# EasyEDA Pro project BLDC_DRIVERv2.eprj

# Schematic Schematic1
Create Date: 2024-09-20; Page Name: P1; Project Name: BLDC_DRIVERv2; Schematic Name: Schematic1; Update Date: 2024-09-20; Company: EasyEDA.com; Drawn: EasyEDA; Page Size: A4; Part Number: JLCPCB-002; Reviewed: EasyEDA; Version: V0.1
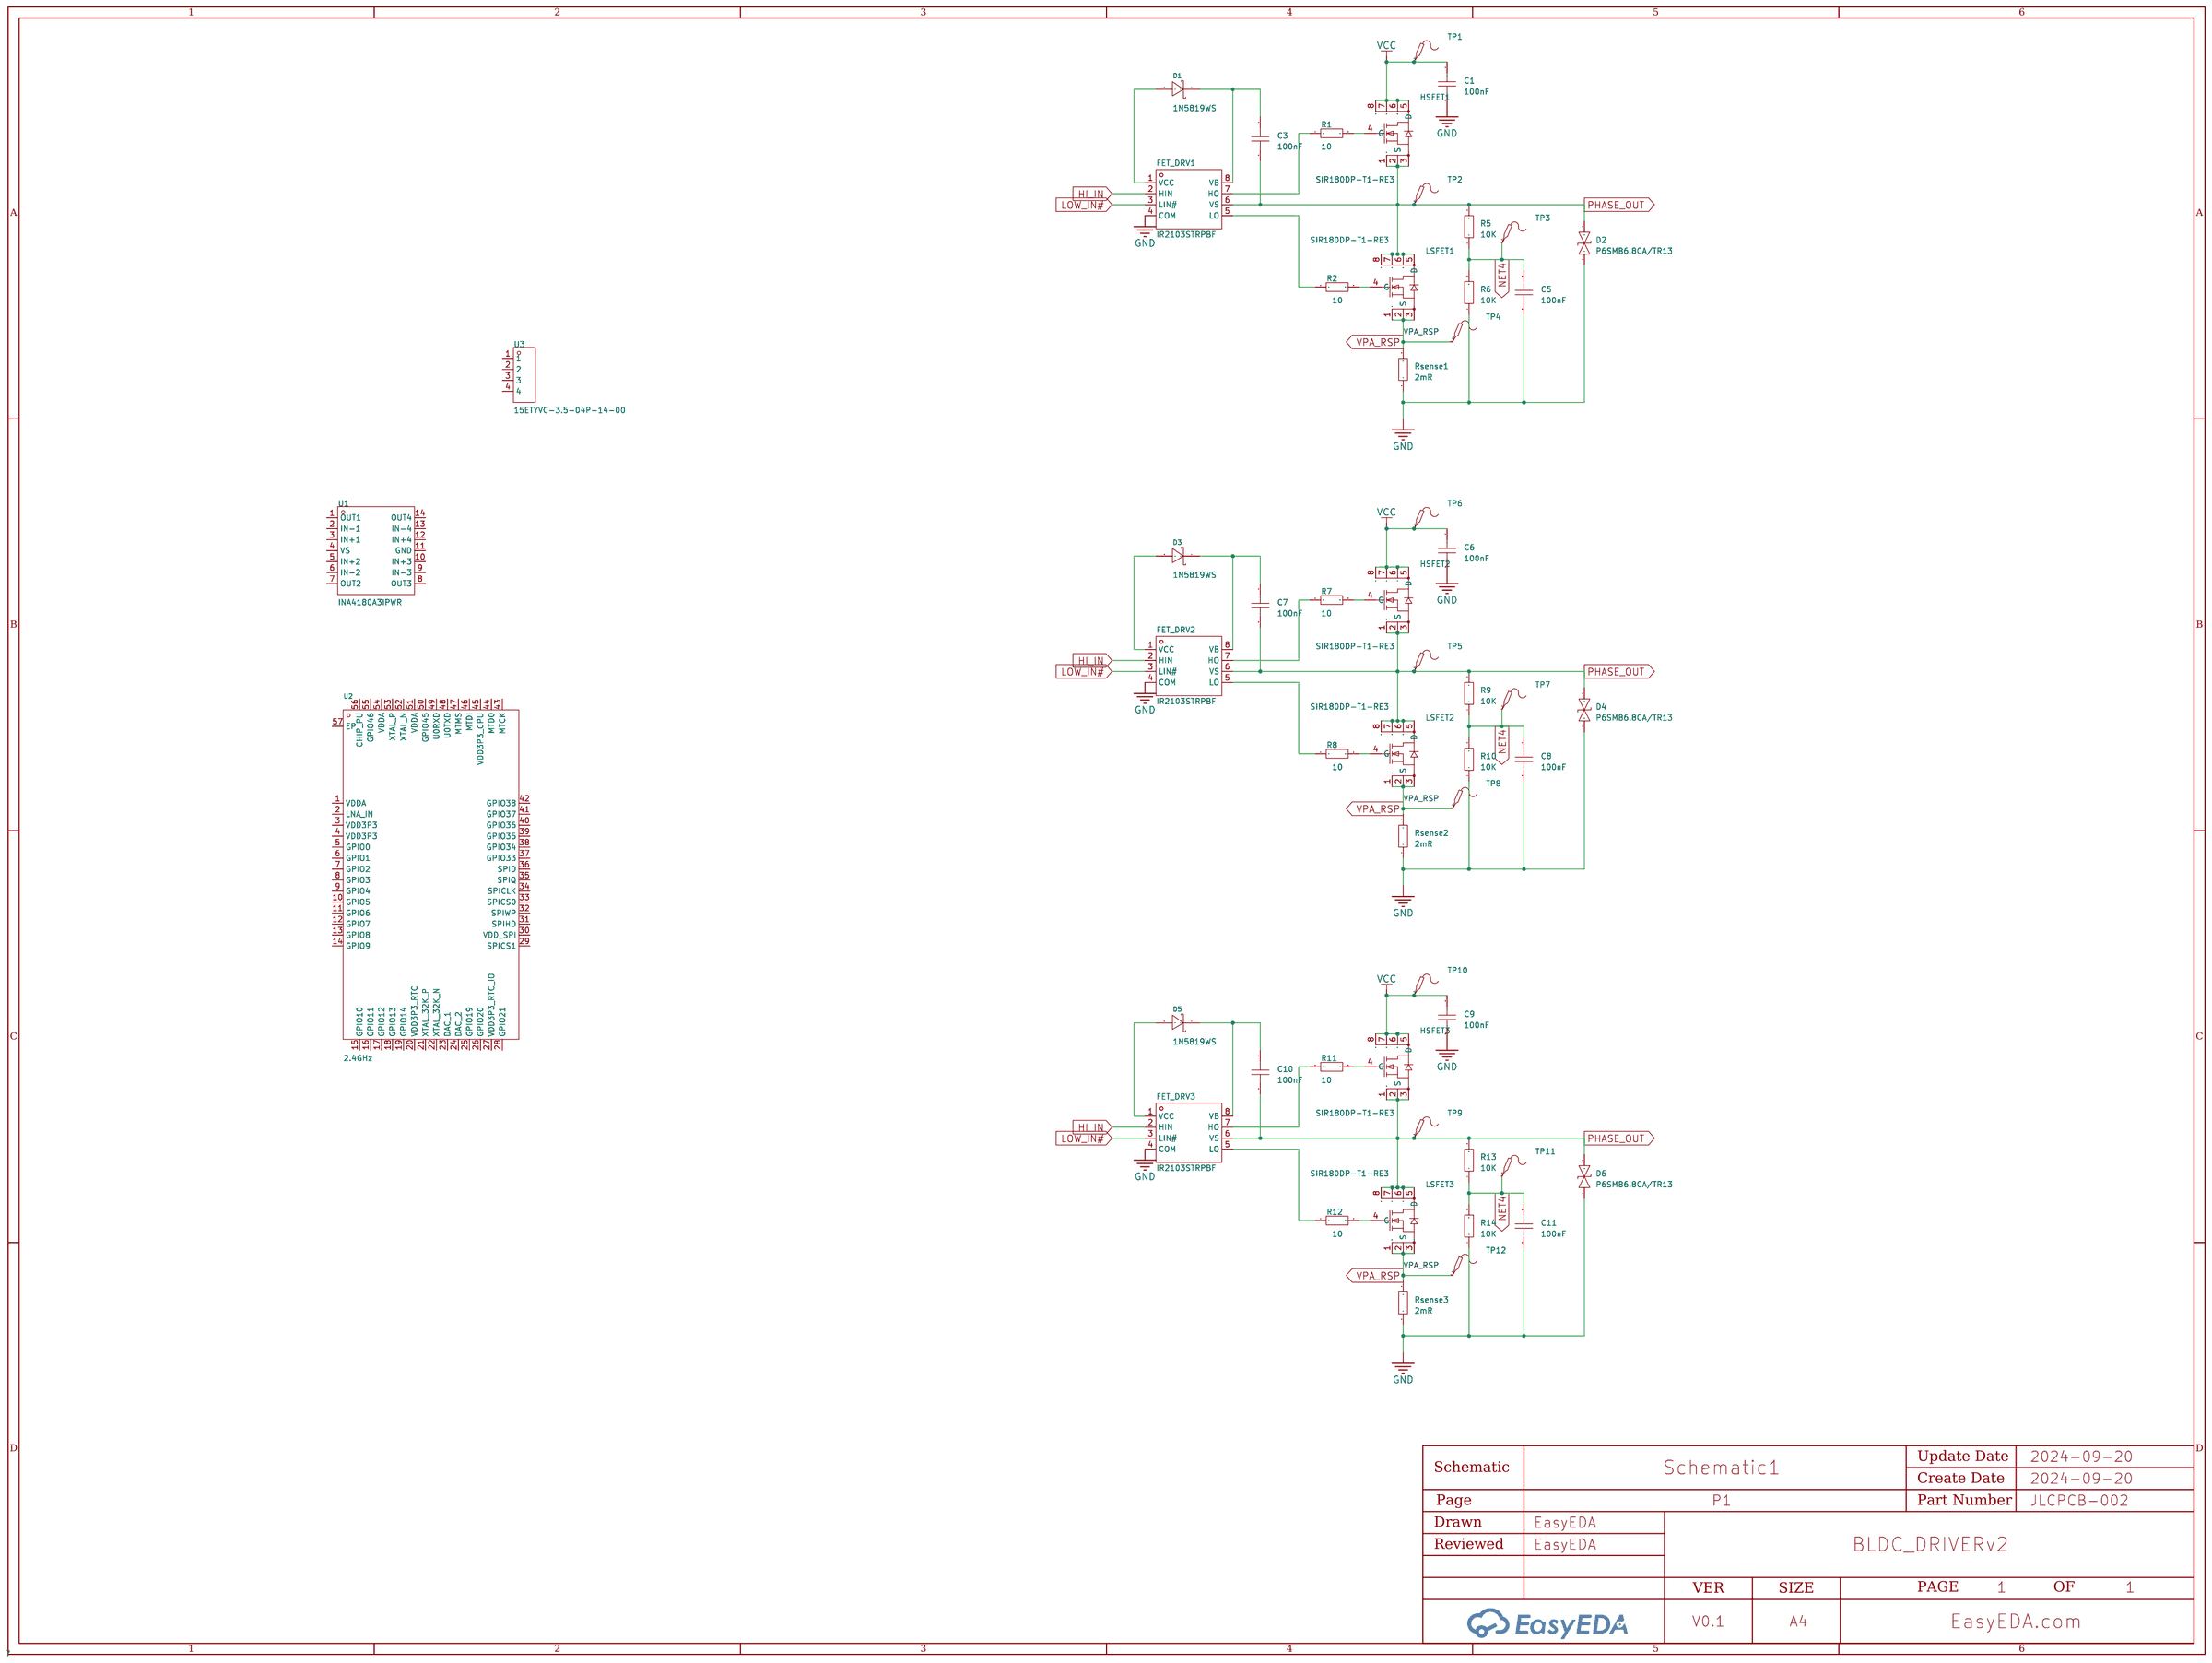
[diagram p0: schematic sheet]

## Parts
C1  100nF  [C0603]
C3  100nF  [C0603]
C5  100nF  [C0603]
C6  100nF  [C0603]
C7  100nF  [C0603]
C8  100nF  [C0603]
C9  100nF  [C0603]
C10  100nF  [C0603]
C11  100nF  [C0603]
D1  1N5819WS  [SOD-323_L1.8-W1.3-LS2.5-RD]
D2  P6SMB6.8CA/TR13  [SMB_L4.6-W3.6-LS5.3-BI]
D3  1N5819WS  [SOD-323_L1.8-W1.3-LS2.5-RD]
D4  P6SMB6.8CA/TR13  [SMB_L4.6-W3.6-LS5.3-BI]
D5  1N5819WS  [SOD-323_L1.8-W1.3-LS2.5-RD]
D6  P6SMB6.8CA/TR13  [SMB_L4.6-W3.6-LS5.3-BI]
FET_DRV1  IR2103STRPBF  [SOIC-8_L4.9-W3.9-P1.27-LS6.0-BL]
FET_DRV2  IR2103STRPBF  [SOIC-8_L4.9-W3.9-P1.27-LS6.0-BL]
FET_DRV3  IR2103STRPBF  [SOIC-8_L4.9-W3.9-P1.27-LS6.0-BL]
HSFET1  SIR180DP-T1-RE3  [POWERPAK-SO-8_L5.9-W4.9-P1.27-LS6.2-BL]
HSFET2  SIR180DP-T1-RE3  [POWERPAK-SO-8_L5.9-W4.9-P1.27-LS6.2-BL]
HSFET3  SIR180DP-T1-RE3  [POWERPAK-SO-8_L5.9-W4.9-P1.27-LS6.2-BL]
LSFET1  SIR180DP-T1-RE3  [POWERPAK-SO-8_L5.9-W4.9-P1.27-LS6.2-BL]
LSFET2  SIR180DP-T1-RE3  [POWERPAK-SO-8_L5.9-W4.9-P1.27-LS6.2-BL]
LSFET3  SIR180DP-T1-RE3  [POWERPAK-SO-8_L5.9-W4.9-P1.27-LS6.2-BL]
R1  10  [R0603]
R2  10  [R0603]
R5  10K  [R0603]
R6  10K  [R0603]
R7  10  [R0603]
R8  10  [R0603]
R9  10K  [R0603]
R10  10K  [R0603]
R11  10  [R0603]
R12  10  [R0603]
R13  10K  [R0603]
R14  10K  [R0603]
Rsense1  2mR  [R0603]
Rsense2  2mR  [R0603]
Rsense3  2mR  [R0603]
TP1  -  [Test-Point-0.5mm]
TP2  -  [Test-Point-0.5mm]
TP3  -  [Test-Point-0.5mm]
TP4  -  [Test-Point-0.5mm]
TP5  -  [Test-Point-0.5mm]
TP6  -  [Test-Point-0.5mm]
TP7  -  [Test-Point-0.5mm]
TP8  -  [Test-Point-0.5mm]
TP9  -  [Test-Point-0.5mm]
TP10  -  [Test-Point-0.5mm]
TP11  -  [Test-Point-0.5mm]
TP12  -  [Test-Point-0.5mm]
U1  INA4180A3IPWR  [TSSOP-14_L5.0-W4.4-P0.65-LS6.4-BL]
U2  2.4GHz  [QFN-56_L7.0-W7.0-P0.40-TL-EP4.6]
U3  15ETYVC-3.5-04P-14-00  [CONN-TH_4P-P3.50_TOPONELEC_15ETYVC-3.5-04P-14-00AH]

## Library data of the parts
C1 C3 C5-C11 = CAP_0603: Supplier Footprint: 0603
D1 D3 D5 = 1N5819WS_C191023: Forward Voltage (Vf@If):600mV@1A Reverse Voltage (Vr):40V Average Rectified Current (Io):1A; LCSC Part Name: 电压:40V 电流:1A; Supplier Part: C191023; Manufacturer: Hottech(合科泰); Supplier Footprint: SOD-323; JLCPCB Part Class: Basic Part; Datasheet: https://atta.szlcsc.com/upload/public/pdf/source/20220428/3CB86FD8D28D653594B4E35F9D5AEFD9.pdf; Supplier: LCSC; Forward Voltage (Vf@If): 600mV@1A; Reverse Voltage (Vr): 40V; Average Rectified Current (Io): 1A
D2 D4 D6 = P6SMB6.8CA/TR13: Reverse Stand-Off Voltage (Vrwm):5.8V Maximum Clamping Voltage:10.5V Peak Pulse Current (Ipp)@10/1000us:58.1A Peak Pulse Power Dissipation (Ppp)@10/1000us:600W Breakdown Voltage:6.45V Type:TVS; Supplier Part: C78395; Manufacturer: Brightking(君耀电子); Supplier Footprint: SMB(DO-214AA); JLCPCB Part Class: Basic Part; Datasheet: https://atta.szlcsc.com/upload/public/pdf/source/20160709/1468031879762.pdf; Supplier: LCSC; Reverse Stand-Off Voltage (Vrwm): 5.8V; Maximum Clamping Voltage: 10.5V; Peak Pulse Current (Ipp)@10/1000us: 58.1A; Peak Pulse Power Dissipation (Ppp)@10/1000us: 600W; Breakdown Voltage: 6.45V; Type: TVS
FET_DRV1-FET_DRV3 = IR2103STRPBF: Driven Configuration:Half Bridge Load Type:MOSFET；IGBT Number of Drivers:2 Peak Output Current(sink):360mA Peak Output Current(source):210mA Supply Voltage:10V~20V Supply Voltage:10V~20V Rise Time:100ns Fall Time:50ns Operating Temperature:-40℃~+150℃@(Tj); Supplier Part: C2957; Manufacturer: Infineon(英飞凌); Supplier Footprint: SOIC-8; JLCPCB Part Class: Extended Part; Datasheet: https://atta.szlcsc.com/upload/public/pdf/source/20140228/1457706997637.pdf; Supplier: LCSC; Driven Configuration: Half Bridge; Load Type: MOSFET；IGBT; Number of Drivers: 2; Peak Output Current(sink): 360mA; Peak Output Current(source): 210mA; Supply Voltage: 10V~20V; Rise Time: 100ns; Fall Time: 50ns; Operating Temperature: -40℃~+150℃@(Tj)
HSFET1-HSFET3 LSFET1-LSFET3 = SIR180DP-T1-RE3: Type:1个NChannel Drain Source Voltage (Vdss):60V Continuous Drain Current (Id):；32.4A Power Dissipation (Pd):； Drain Source On Resistance (RDS(on)@Vgs,Id):2.05mΩ@10A,10V Gate Threshold Voltage (Vgs(th)@Id):3.6V@250uA Total Gate Charge (Qg@Vgs):87nC@10V Inp; LCSC Part Name: 1个N沟道 耐压:60V 电流:60A 电流:32.4A; Supplier Part: C5334421; Manufacturer: VISHAY(威世); Supplier Footprint: SO-8; JLCPCB Part Class: Extended Part; Datasheet: https://atta.szlcsc.com/upload/public/pdf/source/20221230/5EAF42ED79532020A551540FC13481A3.pdf; Supplier: LCSC; Type: 1个NChannel; Drain Source Voltage (Vdss): 60V; Continuous Drain Current (Id): ；32.4A; Power Dissipation (Pd): ；; Drain Source On Resistance (RDS(on)@Vgs,Id): 2.05mΩ@10A,10V; Gate Threshold Voltage (Vgs(th)@Id): 3.6V@250uA; Total Gate Charge (Qg@Vgs): 87nC@10V; Input Capacitance (Ciss@Vds): 4.03nF@30V; Operating Temperature: -55℃~+150℃@(Tj)
R1 R2 R5-R14 Rsense1-Rsense3 = Res_0603: Supplier Footprint: 0603
TP1-TP12 = Test-Point: Test Point 测试点
U1 = INA4180A3IPWR: Number of Channels:Quad Supply Current:690uA Operating Temperature:-40℃~+125℃ Operating Temperature:-40℃~+125℃; Supplier Part: C2057526; Manufacturer: TI(德州仪器); Supplier Footprint: TSSOP-14; JLCPCB Part Class: Extended Part; Datasheet: https://www.ti.com/cn/lit/gpn/ina180; Supplier: LCSC; Number of Channels: Quad; Supply Current: 690uA; Operating Temperature: -40℃~+125℃
U2 = ESP32-S2FN4R2: Core Processor:ESP32-S2芯片 Support Interface:I2C；GPIO；SPI；PWM；ADC；UART；USB；I2S Frequency:2.4GHz Output Power:19.5dBm Output Power:19.5dBm; Supplier Part: C2844252; Manufacturer: ESPRESSIF(乐鑫); Supplier Footprint: QFN-56-EP(7x7); JLCPCB Part Class: Extended Part; Datasheet: https://atta.szlcsc.com/upload/public/pdf/source/20210706/C2844252_73B90DB71B1428E237C1006DEABA1974.pdf; Supplier: LCSC; Core Processor: ESP32-S2芯片; Support Interface: I2C；GPIO；SPI；PWM；ADC；UART；USB；I2S; Output Power: 19.5dBm
U3 = 15ETYVC-3.5-04P-14-00: LCSC Part Name: Toponelec(上海拓宜)端子，3.5mm间距连接器直针插座不带法兰; Supplier Part: C22387635; Manufacturer: Toponelec(拓宜); Supplier Footprint: 插件,P=3.5mm; JLCPCB Part Class: Extended Part; Datasheet: https://atta.szlcsc.com/upload/public/pdf/source/20240425/18F562A3E4003117F60A5CD07DD87476.pdf; Supplier: LCSC

## Nets
GND: C1.2 C5.2 C6.2 C8.2 C9.2 C11.2 D2.1 D4.1 D6.1 FET_DRV1.4(COM) FET_DRV2.4(COM) FET_DRV3.4(COM) R6.1 R10.1 R14.1 Rsense1.1 Rsense2.1 Rsense3.1
VCC: C1.1 C6.1 C9.1 HSFET1.5(D) HSFET1.6(D) HSFET1.7(D) HSFET1.8(D) HSFET2.5(D) HSFET2.6(D) HSFET2.7(D) HSFET2.8(D) HSFET3.5(D) HSFET3.6(D) HSFET3.7(D) HSFET3.8(D) TP1.1 TP6.1 TP10.1
HI_IN: FET_DRV1.2(HIN) FET_DRV2.2(HIN) FET_DRV3.2(HIN)
LOW_IN#: FET_DRV1.3(LIN#) FET_DRV2.3(LIN#) FET_DRV3.3(LIN#)
NET4: C5.1 C8.1 C11.1 R5.1 R6.2 R9.1 R10.2 R13.1 R14.2 TP3.1 TP7.1 TP11.1
PHASE_OUT: C3.2 C7.2 C10.2 D2.2 D4.2 D6.2 FET_DRV1.6(VS) FET_DRV2.6(VS) FET_DRV3.6(VS) HSFET1.1(S) HSFET1.2(S) HSFET1.3(S) HSFET2.1(S) HSFET2.2(S) HSFET2.3(S) HSFET3.1(S) HSFET3.2(S) HSFET3.3(S) LSFET1.5(D) LSFET1.6(D) LSFET1.7(D) LSFET1.8(D) LSFET2.5(D) LSFET2.6(D) LSFET2.7(D) LSFET2.8(D) LSFET3.5(D) LSFET3.6(D) LSFET3.7(D) LSFET3.8(D) R5.2 R9.2 R13.2 TP2.1 TP5.1 TP9.1
VPA_RSP: LSFET1.1(S) LSFET1.2(S) LSFET1.3(S) LSFET2.1(S) LSFET2.2(S) LSFET2.3(S) LSFET3.1(S) LSFET3.2(S) LSFET3.3(S) Rsense1.2 Rsense2.2 Rsense3.2 TP4.1 TP8.1 TP12.1
$1N5826: FET_DRV1.7(HO) R1.1
$1N5827: HSFET1.4(G) R1.2
$1N5828: FET_DRV1.5(LO) R2.1
$1N5829: LSFET1.4(G) R2.2
$1N5840: D1.2(A) FET_DRV1.1(VCC)
$1N5843: C3.1 D1.1(K) FET_DRV1.8(VB)
$1N6438: FET_DRV2.7(HO) R7.1
$1N6439: HSFET2.4(G) R7.2
$1N6440: FET_DRV2.5(LO) R8.1
$1N6441: LSFET2.4(G) R8.2
$1N6452: D3.2(A) FET_DRV2.1(VCC)
$1N6455: C7.1 D3.1(K) FET_DRV2.8(VB)
$1N7050: FET_DRV3.7(HO) R11.1
$1N7051: HSFET3.4(G) R11.2
$1N7052: FET_DRV3.5(LO) R12.1
$1N7053: LSFET3.4(G) R12.2
$1N7064: D5.2(A) FET_DRV3.1(VCC)
$1N7067: C10.1 D5.1(K) FET_DRV3.8(VB)

Not connected (* = marked no-connect by the designer): U1 1(OUT1) 2(IN-1) 3(IN+1) 4(VS) 5(IN+2) 6(IN-2) 7(OUT2) 8(OUT3) 9(IN-3) 10(IN+3) 11(GND) 12(IN+4) 13(IN-4) 14(OUT4); U2 1(VDDA) 2(LNA_IN) 3(VDD3P3) 4(VDD3P3) 5(GPIO0) 6(GPIO1) 7(GPIO2) 8(GPIO3) 9(GPIO4) 10(GPIO5) 11(GPIO6) 12(GPIO7) 13(GPIO8) 14(GPIO9) 15(GPIO10) 16(GPIO11) 17(GPIO12) 18(GPIO13) 19(GPIO14) 20(VDD3P3_RTC) 21(XTAL_32K_P) 22(XTAL_32K_N) 23(DAC_1) 24(DAC_2) 25(GPIO19) 26(GPIO20) 27(VDD3P3_RTC_IO) 28(GPIO21) 29(SPICS1) 30(VDD_SPI) 31(SPIHD) 32(SPIWP) 33(SPICS0) 34(SPICLK) 35(SPIQ) 36(SPID) 37(GPIO33) 38(GPIO34) 39(GPIO35) 40(GPIO36) 41(GPIO37) 42(GPIO38) 43(MTCK) 44(MTD0) 45(VDD3P3_CPU) 46(MTDI) 47(MTMS) 48(U0TXD) 49(U0RXD) 50(GPIO45) 51(VDDA) 52(XTAL_N) 53(XTAL_P) 54(VDDA) 55(GPIO46) 56(CHIP_PU) 57(EP); U3 1 2 3 4

# Schematic PCBPhase
Create Date: 2024-09-20; Page Name: P1; Project Name: PCBPhase; Schematic Name: PCBPhase; Update Date: 2024-09-19; Company: EasyEDA.com; Drawn: EasyEDA; Page Size: A4; Part Number: JLCPCB-002; Reviewed: EasyEDA; Version: V0.1
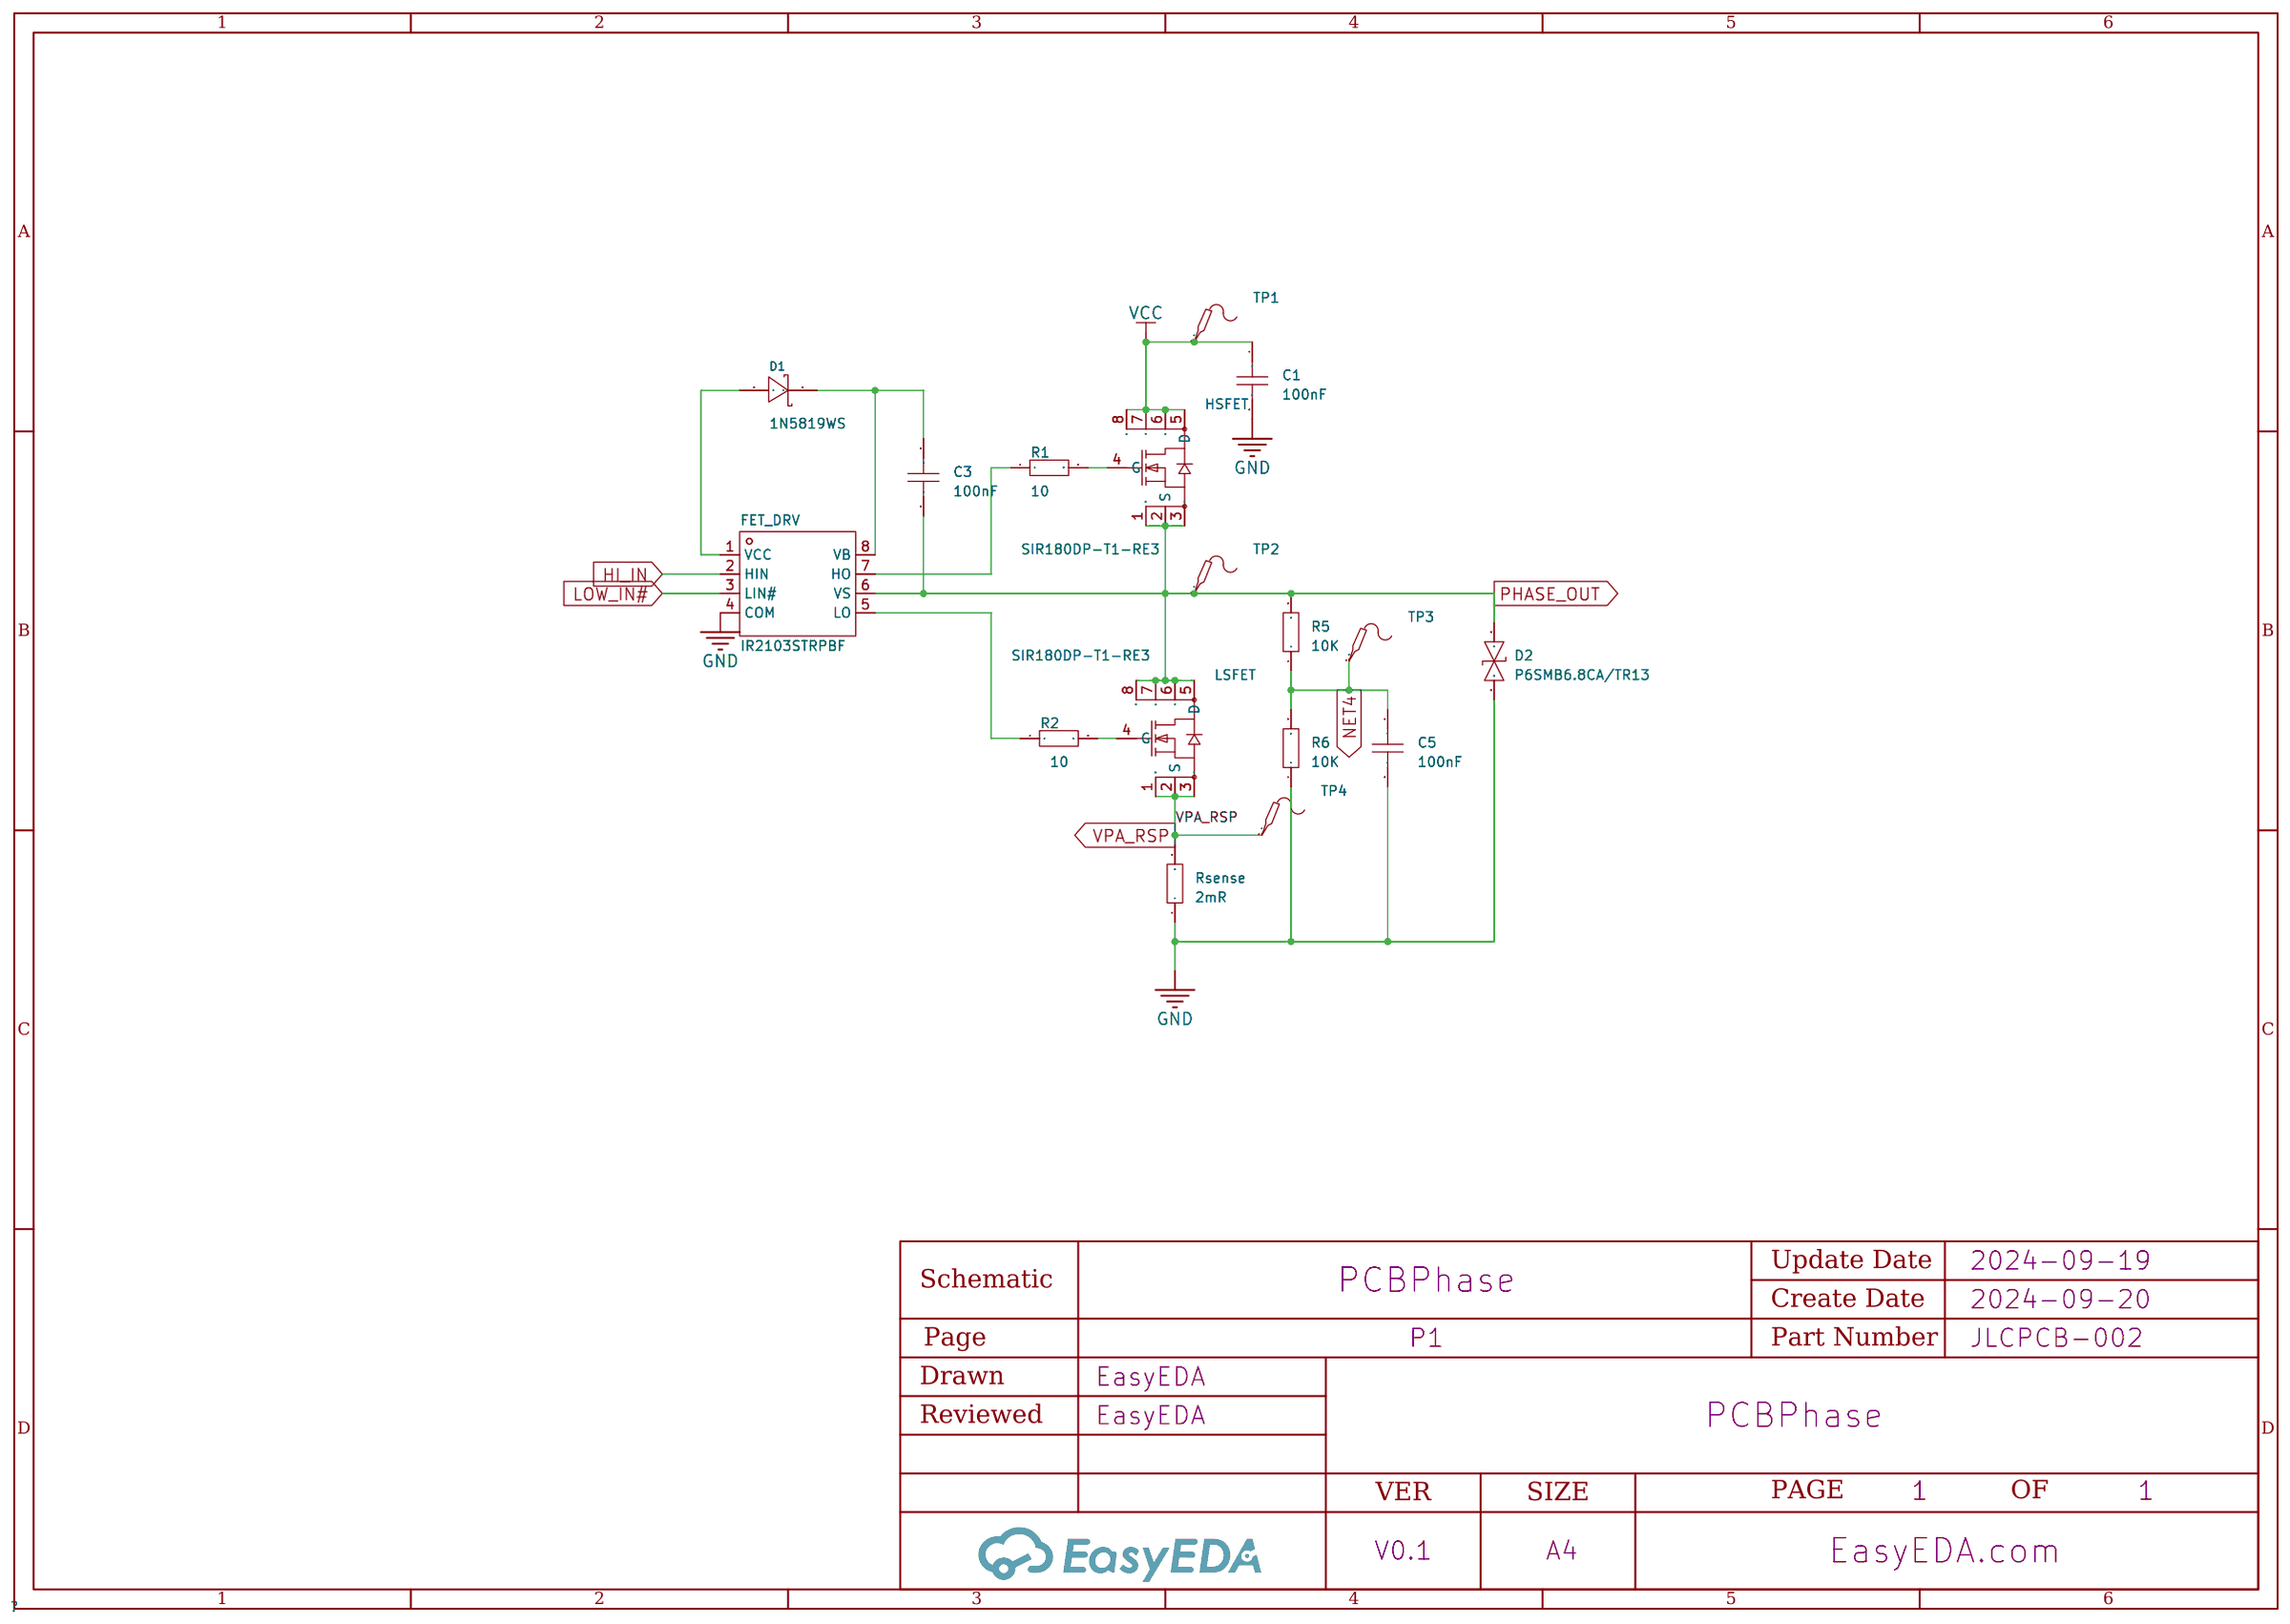
[diagram p1: schematic sheet]

## Parts
C1  100nF  [C0603]
C3  100nF  [C0603]
C5  100nF  [C0603]
D1  1N5819WS  [SOD-323_L1.8-W1.3-LS2.5-RD]
D2  P6SMB6.8CA/TR13  [SMB_L4.6-W3.6-LS5.3-BI]
FET_DRV  IR2103STRPBF  [SOIC-8_L4.9-W3.9-P1.27-LS6.0-BL]
HSFET  SIR180DP-T1-RE3  [POWERPAK-SO-8_L5.9-W4.9-P1.27-LS6.2-BL]
LSFET  SIR180DP-T1-RE3  [POWERPAK-SO-8_L5.9-W4.9-P1.27-LS6.2-BL]
R1  10  [R0603]
R2  10  [R0603]
R5  10K  [R0603]
R6  10K  [R0603]
Rsense  2mR  [R0603]
TP1  -  [Test-Point-0.5mm]
TP2  -  [Test-Point-0.5mm]
TP3  -  [Test-Point-0.5mm]
TP4  -  [Test-Point-0.5mm]

## Library data of the parts
C1 C3 C5 = CAP_0603: Supplier Footprint: 0603
D1 = 1N5819WS_C191023: Forward Voltage (Vf@If):600mV@1A Reverse Voltage (Vr):40V Average Rectified Current (Io):1A; LCSC Part Name: 电压:40V 电流:1A; Supplier Part: C191023; Manufacturer: Hottech(合科泰); Supplier Footprint: SOD-323; JLCPCB Part Class: Basic Part; Datasheet: https://atta.szlcsc.com/upload/public/pdf/source/20220428/3CB86FD8D28D653594B4E35F9D5AEFD9.pdf; Supplier: LCSC; Forward Voltage (Vf@If): 600mV@1A; Reverse Voltage (Vr): 40V; Average Rectified Current (Io): 1A
D2 = P6SMB6.8CA/TR13: Reverse Stand-Off Voltage (Vrwm):5.8V Maximum Clamping Voltage:10.5V Peak Pulse Current (Ipp)@10/1000us:58.1A Peak Pulse Power Dissipation (Ppp)@10/1000us:600W Breakdown Voltage:6.45V Type:TVS; Supplier Part: C78395; Manufacturer: Brightking(君耀电子); Supplier Footprint: SMB(DO-214AA); JLCPCB Part Class: Basic Part; Datasheet: https://atta.szlcsc.com/upload/public/pdf/source/20160709/1468031879762.pdf; Supplier: LCSC; Reverse Stand-Off Voltage (Vrwm): 5.8V; Maximum Clamping Voltage: 10.5V; Peak Pulse Current (Ipp)@10/1000us: 58.1A; Peak Pulse Power Dissipation (Ppp)@10/1000us: 600W; Breakdown Voltage: 6.45V; Type: TVS
FET_DRV = IR2103STRPBF: Driven Configuration:Half Bridge Load Type:MOSFET；IGBT Number of Drivers:2 Peak Output Current(sink):360mA Peak Output Current(source):210mA Supply Voltage:10V~20V Supply Voltage:10V~20V Rise Time:100ns Fall Time:50ns Operating Temperature:-40℃~+150℃@(Tj); Supplier Part: C2957; Manufacturer: Infineon(英飞凌); Supplier Footprint: SOIC-8; JLCPCB Part Class: Extended Part; Datasheet: https://atta.szlcsc.com/upload/public/pdf/source/20140228/1457706997637.pdf; Supplier: LCSC; Driven Configuration: Half Bridge; Load Type: MOSFET；IGBT; Number of Drivers: 2; Peak Output Current(sink): 360mA; Peak Output Current(source): 210mA; Supply Voltage: 10V~20V; Rise Time: 100ns; Fall Time: 50ns; Operating Temperature: -40℃~+150℃@(Tj)
HSFET LSFET = SIR180DP-T1-RE3: Type:1个NChannel Drain Source Voltage (Vdss):60V Continuous Drain Current (Id):；32.4A Power Dissipation (Pd):； Drain Source On Resistance (RDS(on)@Vgs,Id):2.05mΩ@10A,10V Gate Threshold Voltage (Vgs(th)@Id):3.6V@250uA Total Gate Charge (Qg@Vgs):87nC@10V Inp; LCSC Part Name: 1个N沟道 耐压:60V 电流:60A 电流:32.4A; Supplier Part: C5334421; Manufacturer: VISHAY(威世); Supplier Footprint: SO-8; JLCPCB Part Class: Extended Part; Datasheet: https://atta.szlcsc.com/upload/public/pdf/source/20221230/5EAF42ED79532020A551540FC13481A3.pdf; Supplier: LCSC; Type: 1个NChannel; Drain Source Voltage (Vdss): 60V; Continuous Drain Current (Id): ；32.4A; Power Dissipation (Pd): ；; Drain Source On Resistance (RDS(on)@Vgs,Id): 2.05mΩ@10A,10V; Gate Threshold Voltage (Vgs(th)@Id): 3.6V@250uA; Total Gate Charge (Qg@Vgs): 87nC@10V; Input Capacitance (Ciss@Vds): 4.03nF@30V; Operating Temperature: -55℃~+150℃@(Tj)
R1 R2 R5 R6 Rsense = Res_0603: Supplier Footprint: 0603
TP1-TP4 = Test-Point: Test Point 测试点

## Nets
GND: C1.2 C5.2 D2.1 FET_DRV.4(COM) R6.1 Rsense.1
VCC: C1.1 HSFET.5(D) HSFET.6(D) HSFET.7(D) HSFET.8(D) TP1.1
HI_IN: FET_DRV.2(HIN)
LOW_IN#: FET_DRV.3(LIN#)
NET4: C5.1 R5.1 R6.2 TP3.1
PHASE_OUT: C3.2 D2.2 FET_DRV.6(VS) HSFET.1(S) HSFET.2(S) HSFET.3(S) LSFET.5(D) LSFET.6(D) LSFET.7(D) LSFET.8(D) R5.2 TP2.1
VPA_RSP: LSFET.1(S) LSFET.2(S) LSFET.3(S) Rsense.2 TP4.1
$1N508: FET_DRV.7(HO) R1.1
$1N509: HSFET.4(G) R1.2
$1N510: FET_DRV.5(LO) R2.1
$1N511: LSFET.4(G) R2.2
$1N519: D1.2(A) FET_DRV.1(VCC)
$1N521: C3.1 D1.1(K) FET_DRV.8(VB)

# Board PCB2
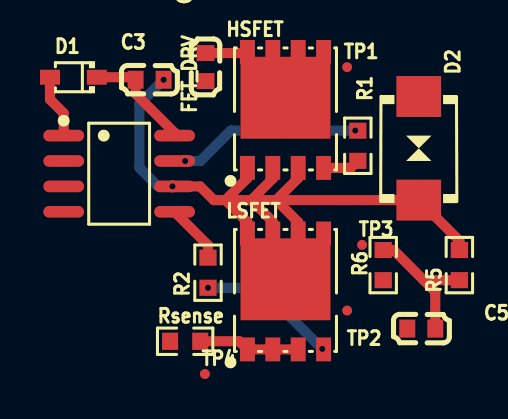
[diagram p2: board, top side]
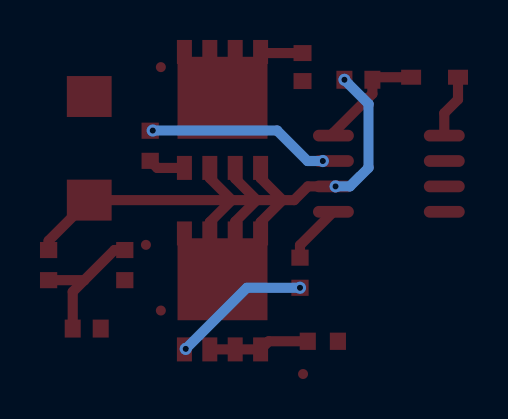
[diagram p3: board, bottom side, seen from below]

No outline. copper layers: Top Layer, Bottom Layer. Coordinates in mm from the lowest, leftmost part position.
Stack: Top Layer 0.035mm / Dielectric1 1.51mm FR4 er 4.5 / Bottom Layer 0.035mm

## Design rules (mm)
template: JLCPCB Capability(Two Layers Board)
spacing copperThickness1oz (default): track to track 0.102, other pairs 0.152 to 0.3
spacing copperThickness2oz: track to track 0.203, other pairs 0.152 to 0.3
track width copperThickness1oz (default): min 0.127, default 0.254, max 2.54
track width copperThickness2oz: min 0.203, default 0.254, max 2.54
differential pair differentialPair (default): width min 0.127, default 0.254, max 2.54; gap min 0.152, default 0.152
via viaSize (default): diameter min 0.5, default 0.61, max 10; hole min 0.3, default 0.305, max 6.3

## Placement (name value [footprint] x y rotation side)
C1  100nF  [C0603]  6.6 15.35 270 top
C3  100nF  [C0603]  3.81 14.72 0 top
C5  100nF  [C0603]  17.4 2.27 180 top
D1  1N5819WS  [SOD-323_L1.8-W1.3-LS2.5-RD]  0 14.85 180 top
D2  P6SMB6.8CA/TR13  [SMB_L4.6-W3.6-LS5.3-BI]  17.27 11.29 270 top
FET_DRV  IR2103STRPBF  [SOIC-8_L4.9-W3.9-P1.27-LS6.0-BL]  2.29 10.02 270 top
HSFET  SIR180DP-T1-RE3  [POWERPAK-SO-8_L5.9-W4.9-P1.27-LS6.2-BL]  10.61 13.21 0 top
LSFET  SIR180DP-T1-RE3  [powerpak-so-8_l5.9-w4.9-p1.27-ls6.2-bl]  10.61 4.13 0 top
R1  10  [R0603]  14.22 11.42 270 top
R2  10  [R0603]  6.73 5.07 270 top
R5  10K  [R0603]  19.3 5.45 90 top
R6  10K  [R0603]  15.49 5.45 90 top
Rsense  2mR  [R0603]  5.59 1.64 0 top
TP1  -  [Test-Point-0.5mm]  13.69 15.35 0 top
TP2  -  [Test-Point-0.5mm]  13.69 3.18 0 top
TP3  -  [Test-Point-0.5mm]  14.44 6.46 0 top
TP4  -  [Test-Point-0.5mm]  6.58 0 0 top

## Footprints (pads in the part's own frame, mm; a bottom-side part is the same pattern mirrored in y, then rotated)
C0603
  rect 0.8x0.9 smd: 1(-0.7,0) 2(0.7,0)
POWERPAK-SO-8_L5.9-W4.9-P1.27-LS6.2-BL
  rect 0.75x1.2 smd: 1(-1.905,-2.9) 2(-0.635,-2.9) 3(0.635,-2.9) 4(1.905,-2.9) 5(1.905,2.9) 6(0.635,2.9) 7(-0.635,2.9) 8(-1.905,2.9)
  rect 4.5x4.1 smd: 8(0,0.609)
powerpak-so-8_l5.9-w4.9-p1.27-ls6.2-bl
  rect 0.75x1.2 smd: 1(-1.905,-2.9) 2(-0.635,-2.9) 3(0.635,-2.9) 4(1.905,-2.9) 5(1.905,2.9) 6(0.635,2.9) 7(-0.635,2.9) 8(-1.905,2.9)
  rect 4.5x4.1 smd: 8(0,0.609)
R0603
  rect 0.806x0.864 smd: 1(-0.753,0) 2(0.753,0)
SMB_L4.6-W3.6-LS5.3-BI
  rect 2.047x2.241 smd: 1(-2.591,0) 2(2.591,0)
SOD-323_L1.8-W1.3-LS2.5-RD
  rect 1x0.75 smd: 1(-1.173,0) 2(1.173,0)
SOIC-8_L4.9-W3.9-P1.27-LS6.0-BL
  oval 0.588x2.045 smd: 1(-1.905,-2.772) 2(-0.635,-2.772) 3(0.635,-2.772) 4(1.905,-2.772) 5(1.905,2.772) 6(0.635,2.772) 7(-0.635,2.772) 8(-1.905,2.772)
Test-Point-0.5mm
  round 0.5 smd: 1(0,0)

## Nets
As in the schematic.

## Via types
v1: diameter 0.61, hole 0.305, Top Layer to Bottom Layer, 6 vias

## Routing (per net, layer and track width the routed paths; a pad name or vN(x,y) marks a point on that pad's centre or on a via; arc(x,y) is an arc through that point)
VCC: length 2.1
  Top Layer w0.508: HSFET.8 8.65,16.05 C1.1
NET4: length 7.1
  Top Layer w0.508: R6.2 16.01,6.2 17.53,4.69 ; R5.1 17.53,4.69 17.53,4.69 ; 17.53,4.69 18.1,4.11 C5.1
PHASE_OUT: length 35.4
  Top Layer w0.508: LSFET.6 11.24,7.6 10.14,8.7 ; 10.14,8.7 11.24,9.8 HSFET.3 ; 10.14,8.7 D2.2 19.3,6.67 R5.2 ; 10.14,8.7 8.89,8.7 ; 7.6,8.7 8.7,7.6 LSFET.8 ; 7.6,8.7 7.02,8.7 6.34,9.38 FET_DRV.6 v1(4.95,9.38) ; 7.6,8.7 8.7,9.8 HSFET.1 ; 7.6,8.7 8.89,8.7 ; 8.89,8.7 9.97,7.62 LSFET.7 ; 8.89,8.7 9.97,9.78 HSFET.2
  Bottom Layer w0.508: v1(4.51,14.72) 3.3,13.51 3.3,10.32 4.23,9.38 v1(4.95,9.38)
VPA_RSP: length 5.1
  Top Layer w0.508: LSFET.3 LSFET.2 LSFET.1 8.29,1.64 Rsense.2
$1N508: length 9.3
  Top Layer w0.254: v1(14.1,12.18) 14.22,12.18 R1.1
  Bottom Layer w0.508: v1(5.59,10.66) 6.35,10.66 7.87,12.18 v1(14.1,12.18)
$1N509: length 1.9
  Top Layer w0.508: HSFET.4 13.87,10.31 R1.2
$1N510: length 3
  Top Layer w0.508: FET_DRV.5 6.73,6.44 R2.1
$1N511: length 7.1
  Top Layer w0.508: LSFET.4 12.49,1.26 v1(12.45,1.26)
  Bottom Layer w0.508: v1(12.45,1.26) 9.39,4.31 v1(6.73,4.31)
$1N519: length 3.2
  Top Layer w0.508: FET_DRV.1 -0.49,13.05 -1.17,13.73 D1.2
$1N521: length 5.6
  Top Layer w0.508: FET_DRV.8 5.06,12.07 3.11,14.01 C3.1 2.98,14.85 D1.1

# Board PCB13
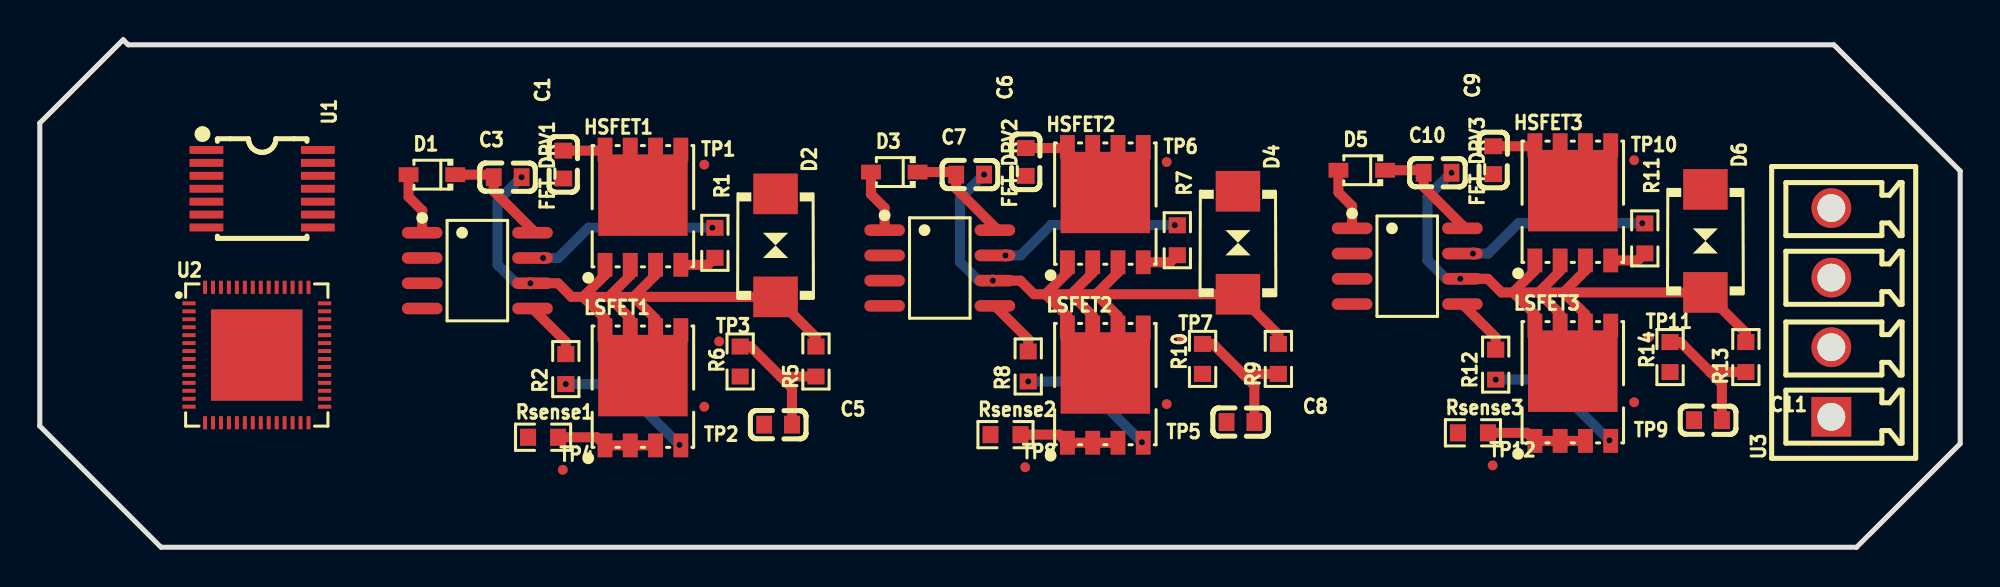
[diagram p4: board, top side]
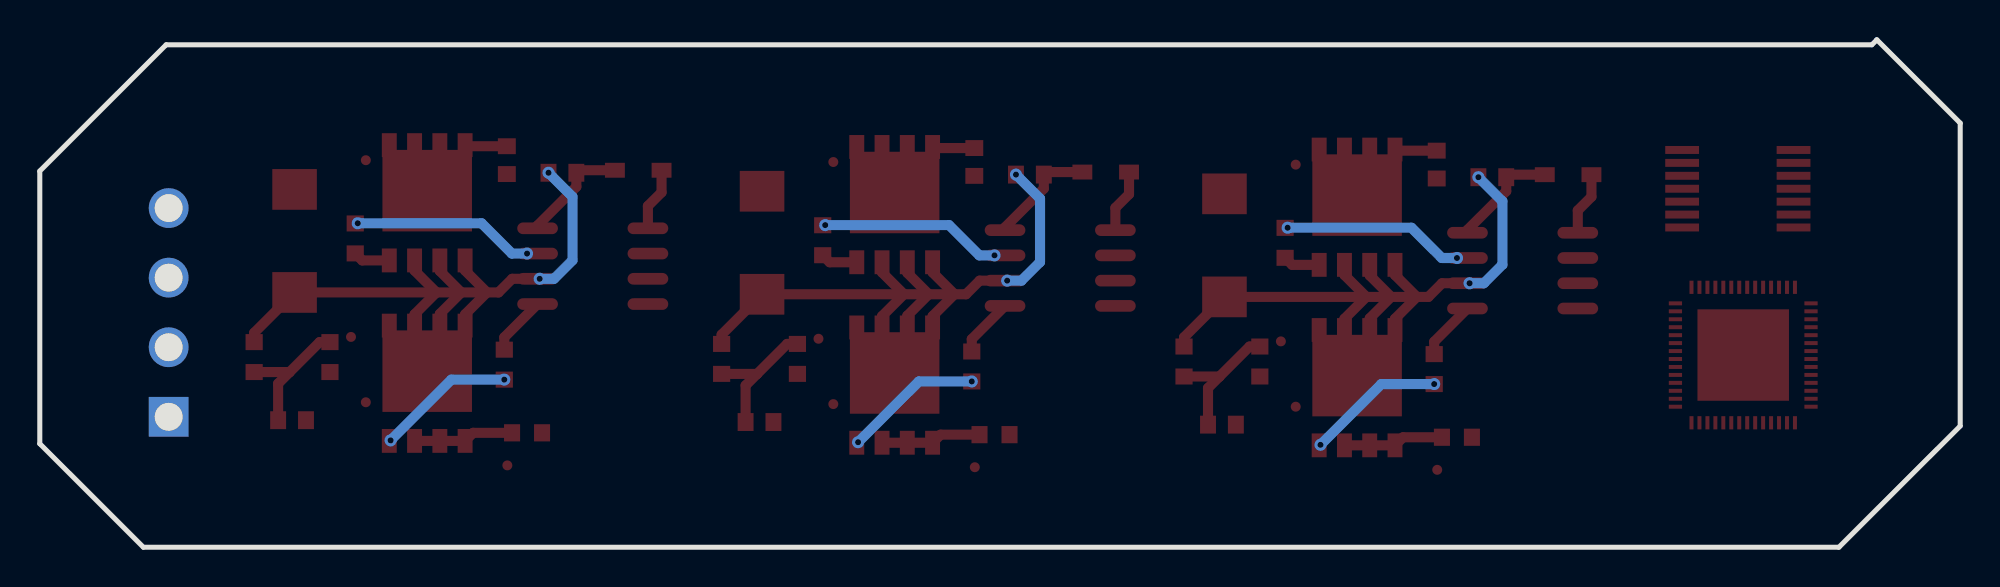
[diagram p5: board, bottom side, seen from below]

Outline 96.52 x 25.53 mm; copper layers: Top Layer, Bottom Layer. Coordinates in mm from the lower left corner of the outline.
Outline path: 0,21.34 0,6.1 6.1,0 91.31,0 96.52,5.21 96.52,18.92 90.17,25.27 4.44,25.27 4.19,25.53 0,21.34
Stack: Top Layer 0.035mm / Dielectric1 1.51mm FR4 er 4.5 / Bottom Layer 0.035mm

## Design rules (mm)
template: JLCPCB Capability(Two Layers Board)
spacing copperThickness1oz (default): track to track 0.102, other pairs 0.152 to 0.3
spacing copperThickness2oz: track to track 0.203, other pairs 0.152 to 0.3
track width copperThickness1oz (default): min 0.127, default 0.254, max 2.54
track width copperThickness2oz: min 0.203, default 0.254, max 2.54
differential pair differentialPair (default): width min 0.127, default 0.254, max 2.54; gap min 0.152, default 0.152
via viaSize (default): diameter min 0.5, default 0.61, max 10; hole min 0.3, default 0.305, max 6.3

## Placement (name value [footprint] x y rotation side)
C1  100nF  [C0603]  26.31 19.25 270 top
C3  100nF  [C0603]  23.52 18.61 0 top
C5  100nF  [C0603]  37.11 6.17 180 top
C6  100nF  [C0603]  49.55 19.38 270 top
C7  100nF  [C0603]  46.76 18.74 0 top
C8  100nF  [C0603]  60.35 6.3 180 top
C9  100nF  [C0603]  73.05 19.47 270 top
C10  100nF  [C0603]  70.25 18.84 0 top
C11  100nF  [C0603]  83.84 6.39 180 top
D1  1N5819WS  [SOD-323_L1.8-W1.3-LS2.5-RD]  19.71 18.74 180 top
D2  P6SMB6.8CA/TR13  [SMB_L4.6-W3.6-LS5.3-BI]  36.98 15.18 270 top
D3  1N5819WS  [SOD-323_L1.8-W1.3-LS2.5-RD]  42.95 18.87 180 top
D4  P6SMB6.8CA/TR13  [SMB_L4.6-W3.6-LS5.3-BI]  60.22 15.32 270 top
D5  1N5819WS  [SOD-323_L1.8-W1.3-LS2.5-RD]  66.44 18.96 180 top
D6  P6SMB6.8CA/TR13  [SMB_L4.6-W3.6-LS5.3-BI]  83.71 15.41 270 top
FET_DRV1  IR2103STRPBF  [SOIC-8_L4.9-W3.9-P1.27-LS6.0-BL]  21.99 13.91 270 top
FET_DRV2  IR2103STRPBF  [SOIC-8_L4.9-W3.9-P1.27-LS6.0-BL]  45.23 14.05 270 top
FET_DRV3  IR2103STRPBF  [SOIC-8_L4.9-W3.9-P1.27-LS6.0-BL]  68.73 14.14 270 top
HSFET1  SIR180DP-T1-RE3  [POWERPAK-SO-8_L5.9-W4.9-P1.27-LS6.2-BL]  30.31 17.1 0 top
HSFET2  SIR180DP-T1-RE3  [POWERPAK-SO-8_L5.9-W4.9-P1.27-LS6.2-BL]  53.55 17.23 0 top
HSFET3  SIR180DP-T1-RE3  [POWERPAK-SO-8_L5.9-W4.9-P1.27-LS6.2-BL]  77.05 17.33 0 top
LSFET1  SIR180DP-T1-RE3  [POWERPAK-SO-8_L5.9-W4.9-P1.27-LS6.2-BL]  30.31 8.03 0 top
LSFET2  SIR180DP-T1-RE3  [POWERPAK-SO-8_L5.9-W4.9-P1.27-LS6.2-BL]  53.55 8.16 0 top
LSFET3  SIR180DP-T1-RE3  [POWERPAK-SO-8_L5.9-W4.9-P1.27-LS6.2-BL]  77.05 8.25 0 top
R1  10  [R0603]  33.93 15.31 270 top
R2  10  [R0603]  26.44 8.96 270 top
R5  10K  [R0603]  39.01 9.34 90 top
R6  10K  [R0603]  35.2 9.34 90 top
R7  10  [R0603]  57.17 15.44 270 top
R8  10  [R0603]  49.68 9.09 270 top
R9  10K  [R0603]  62.25 9.47 90 top
R10  10K  [R0603]  58.44 9.47 90 top
R11  10  [R0603]  80.67 15.53 270 top
R12  10  [R0603]  73.17 9.18 270 top
R13  10K  [R0603]  85.75 9.57 90 top
R14  10K  [R0603]  81.94 9.57 90 top
Rsense1  2mR  [R0603]  25.29 5.53 0 top
Rsense2  2mR  [R0603]  48.54 5.66 0 top
Rsense3  2mR  [R0603]  72.03 5.76 0 top
TP1  -  [Test-Point-0.5mm]  33.4 19.25 0 top
TP2  -  [Test-Point-0.5mm]  33.4 7.07 0 top
TP3  -  [Test-Point-0.5mm]  34.14 10.36 0 top
TP4  -  [Test-Point-0.5mm]  26.28 3.89 0 top
TP5  -  [Test-Point-0.5mm]  56.64 7.2 0 top
TP6  -  [Test-Point-0.5mm]  56.64 19.38 0 top
TP7  -  [Test-Point-0.5mm]  57.38 10.49 0 top
TP8  -  [Test-Point-0.5mm]  49.53 4.03 0 top
TP9  -  [Test-Point-0.5mm]  80.13 7.29 0 top
TP10  -  [Test-Point-0.5mm]  80.13 19.47 0 top
TP11  -  [Test-Point-0.5mm]  80.88 10.58 0 top
TP12  -  [Test-Point-0.5mm]  73.02 4.12 0 top
U1  INA4180A3IPWR  [TSSOP-14_L5.0-W4.4-P0.65-LS6.4-BL]  11.18 18.03 270 top
U2  2.4GHz  [QFN-56_L7.0-W7.0-P0.40-TL-EP4.6]  10.91 9.67 0 top
U3  15ETYVC-3.5-04P-14-00  [CONN-TH_4P-P3.50_TOPONELEC_15ETYVC-3.5-04P-14-00AH]  90.04 11.81 90 top

## Footprints (pads in the part's own frame, mm; a bottom-side part is the same pattern mirrored in y, then rotated)
C0603
  rect 0.8x0.9 smd: 1(-0.7,0) 2(0.7,0)
CONN-TH_4P-P3.50_TOPONELEC_15ETYVC-3.5-04P-14-00AH
  rect 2x2 hole 1.4: 1(-5.25,0)
  round 2 hole 1.4: 2(-1.75,0) 3(1.75,0) 4(5.25,0)
POWERPAK-SO-8_L5.9-W4.9-P1.27-LS6.2-BL
  rect 0.75x1.2 smd: 1(-1.905,-2.9) 2(-0.635,-2.9) 3(0.635,-2.9) 4(1.905,-2.9) 5(1.905,2.9) 6(0.635,2.9) 7(-0.635,2.9) 8(-1.905,2.9)
  rect 4.5x4.1 smd: 8(0,0.609)
QFN-56_L7.0-W7.0-P0.40-TL-EP4.6
  rect 0.665x0.2 smd: 1(-3.408,2.6) 2(-3.408,2.2) 3(-3.408,1.8) 4(-3.408,1.4) 5(-3.408,1) 6(-3.408,0.6) 7(-3.408,0.2) 8(-3.408,-0.2) 9(-3.408,-0.6) 10(-3.408,-1) 11(-3.408,-1.4) 12(-3.408,-1.8) 13(-3.408,-2.2) 14(-3.408,-2.6) 29(3.408,-2.6) 30(3.408,-2.2) 31(3.408,-1.8) 32(3.408,-1.4) 33(3.408,-1) 34(3.408,-0.6) 35(3.408,-0.2) 36(3.408,0.2) 37(3.408,0.6) 38(3.408,1) 39(3.408,1.4) 40(3.408,1.8) 41(3.408,2.2) 42(3.408,2.6)
  rect 0.2x0.665 smd: 15(-2.6,-3.408) 16(-2.2,-3.408) 17(-1.8,-3.408) 18(-1.4,-3.408) 19(-1,-3.408) 20(-0.6,-3.408) 21(-0.2,-3.408) 22(0.2,-3.408) 23(0.6,-3.408) 24(1,-3.408) 25(1.4,-3.408) 26(1.8,-3.408) 27(2.2,-3.408) 28(2.6,-3.408) 43(2.6,3.408) 44(2.2,3.408) 45(1.8,3.408) 46(1.4,3.408) 47(1,3.408) 48(0.6,3.408) 49(0.2,3.408) 50(-0.2,3.408) 51(-0.6,3.408) 52(-1,3.408) 53(-1.4,3.408) 54(-1.8,3.408) 55(-2.2,3.408) 56(-2.6,3.408)
  rect 4.6x4.6 smd: 57(0,0)
R0603
  rect 0.806x0.864 smd: 1(-0.753,0) 2(0.753,0)
SMB_L4.6-W3.6-LS5.3-BI
  rect 2.047x2.241 smd: 1(-2.591,0) 2(2.591,0)
SOD-323_L1.8-W1.3-LS2.5-RD
  rect 1x0.75 smd: 1(-1.173,0) 2(1.173,0)
SOIC-8_L4.9-W3.9-P1.27-LS6.0-BL
  oval 0.588x2.045 smd: 1(-1.905,-2.772) 2(-0.635,-2.772) 3(0.635,-2.772) 4(1.905,-2.772) 5(1.905,2.772) 6(0.635,2.772) 7(-0.635,2.772) 8(-1.905,2.772)
Test-Point-0.5mm
  round 0.5 smd: 1(0,0)
TSSOP-14_L5.0-W4.4-P0.65-LS6.4-BL
  rect 0.4x1.7 smd: 1(-1.95,-2.8) 2(-1.3,-2.8) 3(-0.65,-2.8) 4(0,-2.8) 5(0.65,-2.8) 6(1.3,-2.8) 7(1.95,-2.8) 8(1.95,2.8) 9(1.3,2.8) 10(0.65,2.8) 11(0,2.8) 12(-0.65,2.8) 13(-1.3,2.8) 14(-1.95,2.8)

## Nets
As in the schematic.

Pads without a net: U1 1 2 3 4 5 6 7 8 9 10 11 12 13 14; U2 1 2 3 4 5 6 7 8 9 10 11 12 13 14 15 16 17 18 19 20 21 22 23 24 25 26 27 28 29 30 31 32 33 34 35 36 37 38 39 40 41 42 43 44 45 46 47 48 49 50 51 52 53 54 55 56 57; U3 1 2 3 4

## Via types
v1: diameter 0.61, hole 0.305, Top Layer to Bottom Layer, 18 vias

## Routing (per net, layer and track width the routed paths; a pad name or vN(x,y) marks a point on that pad's centre or on a via; arc(x,y) is an arc through that point)
VCC: length 6.4
  Top Layer w0.508: C6.1 51.59,20.08 HSFET2.8 ; C1.1 28.35,19.95 HSFET1.8 ; C9.1 75.09,20.17 HSFET3.8
NET4: length 21.3
  Top Layer w0.508: 37.23,8.58 37.81,8.01 C5.1 ; 37.23,8.58 35.72,10.1 R6.2 ; 37.23,8.58 37.24,8.59 R5.1 ; 60.47,8.71 58.96,10.23 R10.2 ; 60.47,8.71 60.48,8.72 R9.1 ; 60.47,8.71 61.05,8.14 C8.1 ; C11.1 84.54,8.23 83.97,8.8 ; 83.97,8.8 82.45,10.32 R14.2 ; 83.97,8.8 83.98,8.81 R13.1
PHASE_OUT: length 106.3
  Top Layer w0.508: 75.34,12.82 76.41,13.9 HSFET3.2 ; 75.34,12.82 74.04,12.82 ; 75.34,12.82 76.58,12.82 ; 75.34,12.82 76.41,11.74 LSFET3.7 ; 30.95,14.2 30.95,13.69 29.85,12.59 ; v1(71.4,13.5) FET_DRV3.6 72.78,13.5 73.46,12.82 74.04,12.82 ; LSFET3.8 75.14,11.72 74.04,12.82 ; R9.2 62.25,10.69 D4.2 53.09,12.72 ; 53.09,12.72 51.84,12.72 ; 53.09,12.72 54.19,13.83 HSFET2.3 ; 53.09,12.72 54.19,11.62 LSFET2.6 ; 29.85,12.59 28.6,12.59 ; 29.85,12.59 30.95,11.49 30.95,10.93 ; 29.85,12.59 D2.2 39.01,10.56 R5.2 ; 28.6,12.59 29.68,11.51 LSFET1.7 ; 28.6,12.59 27.31,12.59 ; 28.6,12.59 29.68,13.67 HSFET1.2 ; R13.2 85.75,10.78 D6.2 76.58,12.82 ; v1(24.66,13.28) FET_DRV1.6 26.04,13.28 26.73,12.59 27.31,12.59 ; HSFET2.2 52.92,13.8 51.84,12.72 ; 50.55,12.72 51.65,13.83 HSFET2.1 ; 50.55,12.72 51.65,11.62 LSFET2.8 ; 50.55,12.72 49.97,12.72 49.28,13.41 FET_DRV2.6 v1(47.9,13.41) ; 50.55,12.72 51.84,12.72 ; 74.04,12.82 75.14,13.92 HSFET3.1 ; 27.31,12.59 28.41,11.49 LSFET1.8 ; 27.31,12.59 28.41,13.69 HSFET1.1 ; 76.58,12.82 77.68,13.92 HSFET3.3 ; 76.58,12.82 77.68,11.72 LSFET3.6 ; 51.84,12.72 52.92,11.65 LSFET2.7
  Bottom Layer w0.508: v1(71.4,13.5) 70.68,13.5 69.74,14.44 69.74,17.63 v1(70.95,18.84) ; v1(47.9,13.41) 47.18,13.41 46.25,14.34 46.25,17.54 v1(47.46,18.74) ; v1(24.22,18.61) 23.01,17.41 23.01,14.21 23.94,13.28 v1(24.66,13.28)
VPA_RSP: length 15.2
  Top Layer w0.508: Rsense2.2 51.24,5.66 LSFET2.1 LSFET2.2 LSFET2.3 ; Rsense1.2 28,5.53 LSFET1.1 LSFET1.2 30.95,5.13 ; Rsense3.2 74.74,5.76 LSFET3.1 LSFET3.2 LSFET3.3
$1N5826: length 9.3
  Top Layer w0.254: R1.1 33.92,16.07 v1(33.8,16.07)
  Bottom Layer w0.508: v1(25.29,14.55) 26.06,14.55 27.58,16.07 v1(33.8,16.07)
$1N5827: length 1.9
  Top Layer w0.508: R1.2 33.58,14.2 HSFET1.4
$1N5828: length 3
  Top Layer w0.508: R2.1 26.44,10.34 FET_DRV1.5
$1N5829: length 7.1
  Top Layer w0.508: LSFET1.4 32.19,5.15 v1(32.15,5.15)
  Bottom Layer w0.508: v1(32.15,5.15) 29.1,8.21 v1(26.44,8.21)
$1N5840: length 3.2
  Top Layer w0.508: D1.2 18.53,17.63 19.22,16.94 FET_DRV1.1
$1N5843: length 5.6
  Top Layer w0.508: D1.1 22.69,18.74 C3.1 22.82,17.91 24.77,15.96 FET_DRV1.8
$1N6438: length 9.3
  Top Layer w0.254: R7.1 57.16,16.2 v1(57.04,16.2)
  Bottom Layer w0.508: v1(48.54,14.68) 49.3,14.68 50.82,16.2 v1(57.04,16.2)
$1N6439: length 1.9
  Top Layer w0.508: HSFET2.4 56.82,14.34 R7.2
$1N6440: length 3
  Top Layer w0.508: R8.1 49.68,10.47 FET_DRV2.5
$1N6441: length 7.1
  Top Layer w0.508: v1(55.39,5.28) 55.43,5.28 LSFET2.4
  Bottom Layer w0.508: v1(55.39,5.28) 52.34,8.34 v1(49.68,8.34)
$1N6452: length 3.2
  Top Layer w0.508: FET_DRV2.1 42.46,17.07 41.78,17.76 D3.2
$1N6455: length 5.6
  Top Layer w0.508: FET_DRV2.8 48.01,16.09 46.06,18.04 C7.1 45.93,18.87 D3.1
$1N7050: length 9.3
  Top Layer w0.254: v1(80.54,16.3) 80.66,16.3 R11.1
  Bottom Layer w0.508: v1(72.03,14.77) 72.79,14.77 74.32,16.3 v1(80.54,16.3)
$1N7051: length 1.9
  Top Layer w0.508: HSFET3.4 80.31,14.43 R11.2
$1N7052: length 3
  Top Layer w0.508: FET_DRV3.5 73.17,10.56 R12.1
$1N7053: length 7.1
  Top Layer w0.508: v1(78.89,5.37) 78.93,5.37 LSFET3.4
  Bottom Layer w0.508: v1(73.17,8.43) 75.83,8.43 v1(78.89,5.37)
$1N7064: length 3.2
  Top Layer w0.508: 65.27,18.96 65.27,17.85 65.96,17.16 FET_DRV3.1
$1N7067: length 5.6
  Top Layer w0.508: D5.1 69.43,18.96 C10.1 69.55,18.13 71.5,16.18 FET_DRV3.8
